# Altium schematic sheet Revision_History.SchDoc: Ixora
size A3; Organization: Toradex AG; Address1: Altsagenstrasse 5; Address2: Horw; Address3: 6048; Address4: Switzerland; DocumentNumber: 1; Revision: V1.1; SheetNumber: 4; SheetTotal: 17; PageSetup: Record=PageOptions|CenterHorizontal=True|CenterVertical=True|PrintScale=0.73|XCorrection=1.00|YCorrection=1.00|PrintKind=0|BorderSize=5000000|LeftOffset=0|BottomOffset=0|Orientation=2|PaperLength=1000|PaperWidth=1000|Scale=100|PaperSource=7|PrintQuality=-4|MediaType=1|DitherType=10|PaperKind=A4|PrintScaleMode=1
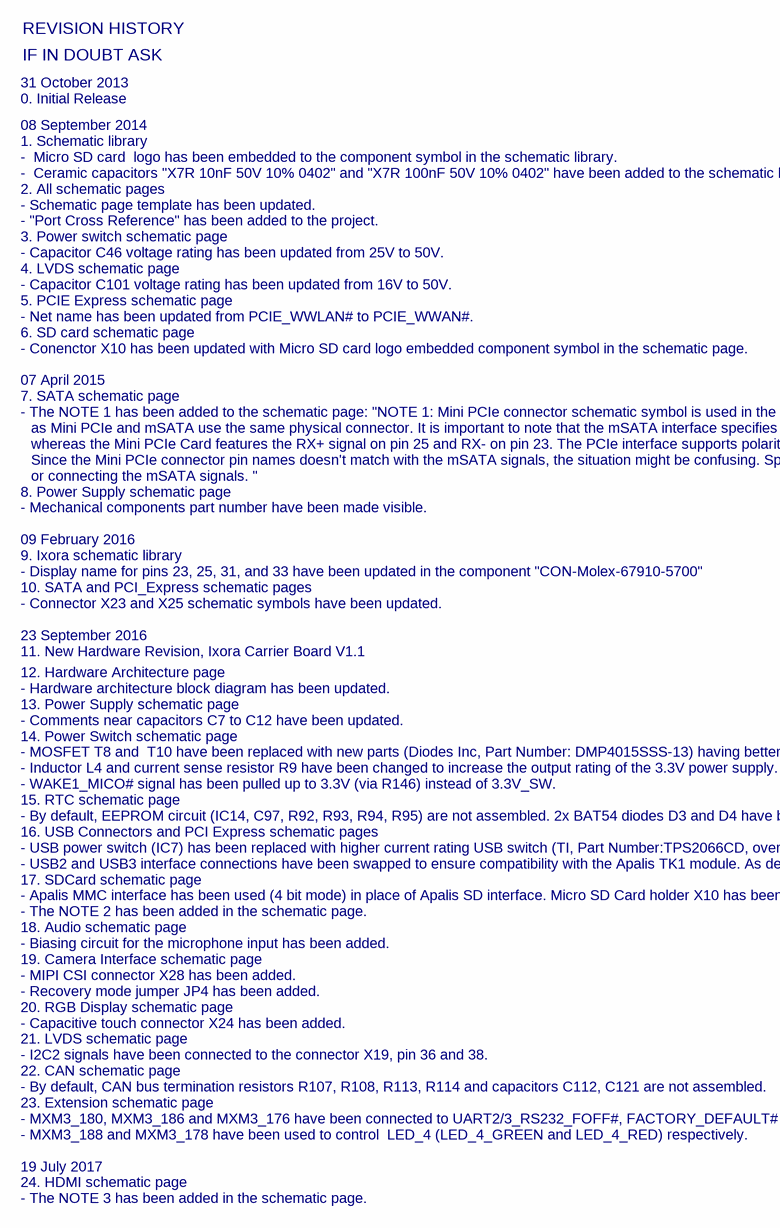
[diagram p0: Revision_History.SchDoc]

## Notes on the sheet
- REVISION HISTORY
- IF IN DOUBT ASK
- 31 October 2013
- 0. Initial Release
- 08 September 2014
- 1. Schematic library
- 2. All schematic pages
- - Schematic page template has been updated.
- -  Micro SD card  logo has been embedded to the component symbol in the schematic library.
- -  Ceramic capacitors "X7R 10nF 50V 10% 0402" and "X7R 100nF 50V 10% 0402" have been added to the schematic library.
- - "Port Cross Reference" has been added to the project.
- - Capacitor C46 voltage rating has been updated from 25V to 50V.
- 3. Power switch schematic page
- 4. LVDS schematic page
- - Capacitor C101 voltage rating has been updated from 16V to 50V.
- - Net name has been updated from PCIE_WWLAN# to PCIE_WWAN#.
- 5. PCIE Express schematic page
- - Conenctor X10 has been updated with Micro SD card logo embedded component symbol in the schematic page.
- 6. SD card schematic page
- 07 April 2015
- - The NOTE 1 has been added to the schematic page: "NOTE 1: Mini PCIe connector schematic symbol is used in the schematic for the mSATA connector (X23),
- 7. SATA schematic page
- as Mini PCIe and mSATA use the same physical connector. It is important to note that the mSATA interface specifies the RX+ signal on pin 23 and RX- signal on pin 25,
- whereas the Mini PCIe Card features the RX+ signal on pin 25 and RX- on pin 23. The PCIe interface supports polarity reversal, but not the SATA interface.
- Since the Mini PCIe connector pin names doesn't match with the mSATA signals, the situation might be confusing. Special attention must be paid while reading
- or connecting the mSATA signals. "
- - Mechanical components part number have been made visible.
- 8. Power Supply schematic page
- 09 February 2016
- - Display name for pins 23, 25, 31, and 33 have been updated in the component "CON-Molex-67910-5700"
- 9. Ixora schematic library
- - Connector X23 and X25 schematic symbols have been updated.
- 10. SATA and PCI_Express schematic pages
- 23 September 2016
- 11. New Hardware Revision, Ixora Carrier Board V1.1
- 12. Hardware Architecture page
- 14. Power Switch schematic page
- - MOSFET T8 and  T10 have been replaced with new parts (Diodes Inc, Part Number: DMP4015SSS-13) having better Vgs rating. Zener diodes (On Semi, Part Number: MM3Z20VT1G) D14 and D16 have been added for MOSFETs gate protection.
- - Hardware architecture block diagram has been updated.
- 13. Power Supply schematic page
- - Comments near capacitors C7 to C12 have been updated.
- 15. RTC schematic page
- - By default, EEPROM circuit (IC14, C97, R92, R93, R94, R95) are not assembled. 2x BAT54 diodes D3 and D4 have been replaced with single BAT54C diode D3.
- - Inductor L4 and current sense resistor R9 have been changed to increase the output rating of the 3.3V power supply.
- - WAKE1_MICO# signal has been pulled up to 3.3V (via R146) instead of 3.3V_SW.
- 16. USB Connectors and PCI Express schematic pages
- - USB power switch (IC7) has been replaced with higher current rating USB switch (TI, Part Number:TPS2066CD, overcurrent limit 1A).
- 17. SDCard schematic page
- - USB2 and USB3 interface connections have been swapped to ensure compatibility with the Apalis TK1 module. As default assembly, USB2 has been connected to the PCIe connector and USB3 has been connected to the connector X7 (USB 1 connector).
- - Apalis MMC interface has been used (4 bit mode) in place of Apalis SD interface. Micro SD Card holder X10 has been replaced with new connector (Wurth, Part Number: 693071010811).
- 18. Audio schematic page
- - Biasing circuit for the microphone input has been added.
- - The NOTE 2 has been added in the schematic page.
- 19. Camera Interface schematic page
- - MIPI CSI connector X28 has been added.
- 20. RGB Display schematic page
- - Capacitive touch connector X24 has been added.
- - Recovery mode jumper JP4 has been added.
- 21. LVDS schematic page
- - I2C2 signals have been connected to the connector X19, pin 36 and 38.
- 22. CAN schematic page
- - By default, CAN bus termination resistors R107, R108, R113, R114 and capacitors C112, C121 are not assembled.
- 23. Extension schematic page
- - MXM3_180, MXM3_186 and MXM3_176 have been connected to UART2/3_RS232_FOFF#, FACTORY_DEFAULT# and PCIE_WDISABLE#_R signals respectively.
- - MXM3_188 and MXM3_178 have been used to control  LED_4 (LED_4_GREEN and LED_4_RED) respectively.
- 19 July 2017
- - The NOTE 3 has been added in the schematic page.
- 24. HDMI schematic page
- Title
- Size:
- Date:
- A3
- Number:
- Time:
- Revision:
- Sheet
- of
- File: